# Altium project CONNECT.PRJPCB
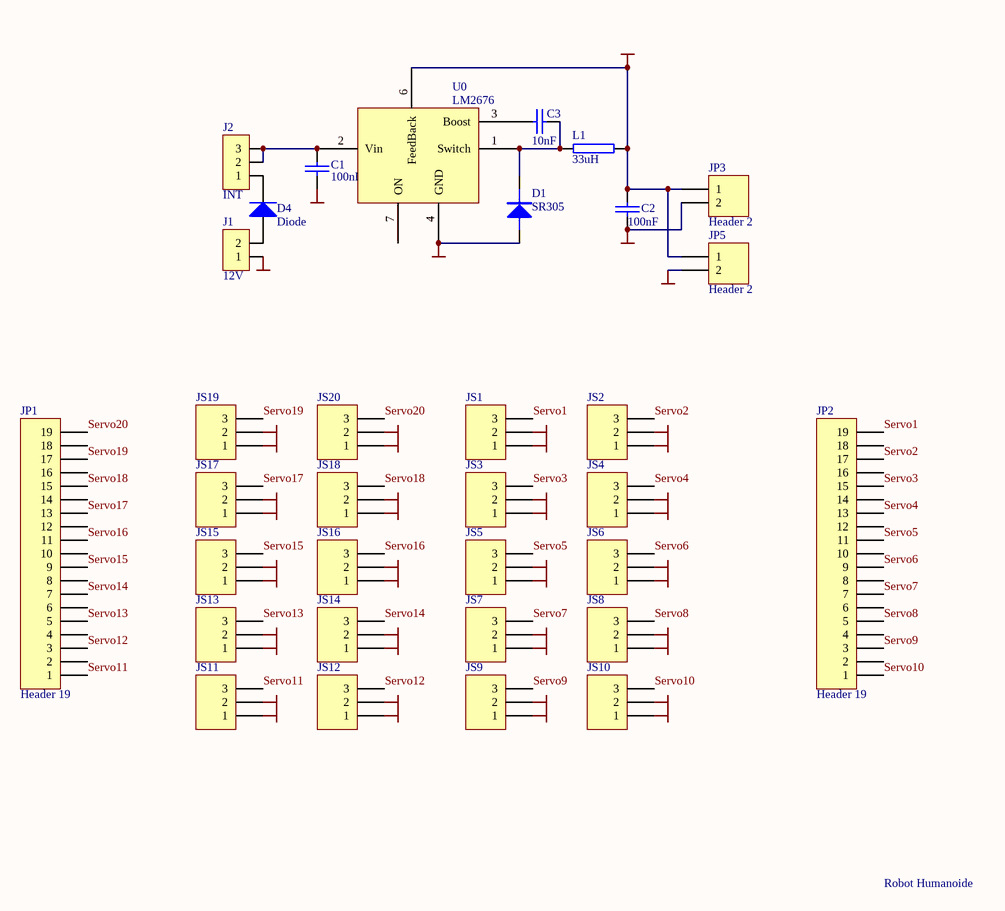
[diagram p0: Connect.SCHDOC]
1 sheet, 33 parts. Net scope: global (net labels, ports and power ports of the same name join across sheets).
Board file: Connect.PCBDOC

## Sheet Connect.SCHDOC
size A4

### Parts
C1  100nF  [0805]
C2  100nF  [0805]
C3  10nF  [0805]
D1  SR305  [1812]
D4  Diode  [DSO-C2/X3.3]
J1  12V  [CON2]
J2  INT  [TSIP3]
JP1  Header 19  [HDR1X19]
JP2  Header 19  [HDR1X19]
JP3  Header 2  [HDR1X2]
JP5  Header 2  [HDR1X2]
JS1  Header 3  [HDR1X3]  (value not drawn)
JS2  Header 3  [HDR1X3]  (value not drawn)
JS3  Header 3  [HDR1X3]  (value not drawn)
JS4  Header 3  [HDR1X3]  (value not drawn)
JS5  Header 3  [HDR1X3]  (value not drawn)
JS6  Header 3  [HDR1X3]  (value not drawn)
JS7  Header 3  [HDR1X3]  (value not drawn)
JS8  Header 3  [HDR1X3]  (value not drawn)
JS9  Header 3  [HDR1X3]  (value not drawn)
JS10  Header 3  [HDR1X3]  (value not drawn)
JS11  Header 3  [HDR1X3]  (value not drawn)
JS12  Header 3  [HDR1X3]  (value not drawn)
JS13  Header 3  [HDR1X3]  (value not drawn)
JS14  Header 3  [HDR1X3]  (value not drawn)
JS15  Header 3  [HDR1X3]  (value not drawn)
JS16  Header 3  [HDR1X3]  (value not drawn)
JS17  Header 3  [HDR1X3]  (value not drawn)
JS18  Header 3  [HDR1X3]  (value not drawn)
JS19  Header 3  [HDR1X3]  (value not drawn)
JS20  Header 3  [HDR1X3]  (value not drawn)
L1  33uH  [TRES]
U0  LM2676  [LM2676]

### Nets
5V: C2.2 JP3.1 JP5.1 JS1.2 JS2.2 JS3.2 JS4.2 JS5.2 JS6.2 JS7.2 JS8.2 JS9.2 JS10.2 JS11.2 JS12.2 JS13.2 JS14.2 JS15.2 JS16.2 JS17.2 JS18.2 JS19.2 JS20.2 L1.2 U0.6(FeedBack)
GND: C1.1 C2.1 D1.2 J1.1 JP3.2 JP5.2 JS1.1 JS2.1 JS3.1 JS4.1 JS5.1 JS6.1 JS7.1 JS8.1 JS9.1 JS10.1 JS11.1 JS12.1 JS13.1 JS14.1 JS15.1 JS16.1 JS17.1 JS18.1 JS19.1 JS20.1 U0.4(GND)
Servo1: JP2.19 JS1.3
Servo2: JP2.17 JS2.3
Servo3: JP2.15 JS3.3
Servo4: JP2.13 JS4.3
Servo5: JP2.11 JS5.3
Servo6: JP2.9 JS6.3
Servo7: JP2.7 JS7.3
Servo8: JP2.5 JS8.3
Servo9: JP2.3 JS9.3
Servo10: JP2.1 JS10.3
Servo11: JP1.1 JS11.3
Servo12: JP1.3 JS12.3
Servo13: JP1.5 JS13.3
Servo14: JP1.7 JS14.3
Servo15: JP1.9 JS15.3
Servo16: JP1.11 JS16.3
Servo17: JP1.13 JS17.3
Servo18: JP1.15 JS18.3
Servo19: JP1.17 JS19.3
Servo20: JP1.19 JS20.3
NetC1_2: C1.2 J2.2 J2.3 U0.2(Vin)
NetC3_1: C3.1 U0.3(Boost)
NetC3_2: C3.2 D1.1 L1.1 U0.1(Switch)
NetD4_1: D4.1(A) J1.2
NetD4_2: D4.2(K) J2.1

Not connected (* = marked no-connect by the designer): JP1 2 4 6 8 10 12 14 16 18; JP2 2 4 6 8 10 12 14 16 18; U0 7(ON)

### Notes on the sheet
- Robot Humanoide

### Library data of the parts
C1 C2 = CAP: Part Field 1: 08/06/2000; Part Field 2: Altium Hobart Technology Centre; Part Field 3: Generic Components; Part Field 4: Passive; Part Field 5: Capacitor
C3 = CONDO
D1 = DIODE
D4 = Diode: Default Diode; Code - JEDEC: DO-214-AB; Published: 8-Jun-2000; Revision: July-2002: Re-released for DXP Platform.; Publisher: Altium Limited
J1 = CON2
J2 = TCON3
JP1 JP2 = Header 19: Header, 19-Pin; Revision: 17-Jul-2002: Re-released for DXP Platform.; Publisher: Altium Limited
JP3 JP5 = Header 2: Header, 2-Pin; Revision: 17-Jul-2002: Re-released for DXP Platform.; Publisher: Altium Limited
JS1-JS20 = Header 3: Header, 3-Pin; Revision: 17-Jul-2002: Re-released for DXP Platform.; Publisher: Altium Limited
L1 = RES2: Published: *; Publisher: *; Manufacturer: *; Class: *; SubClass: *